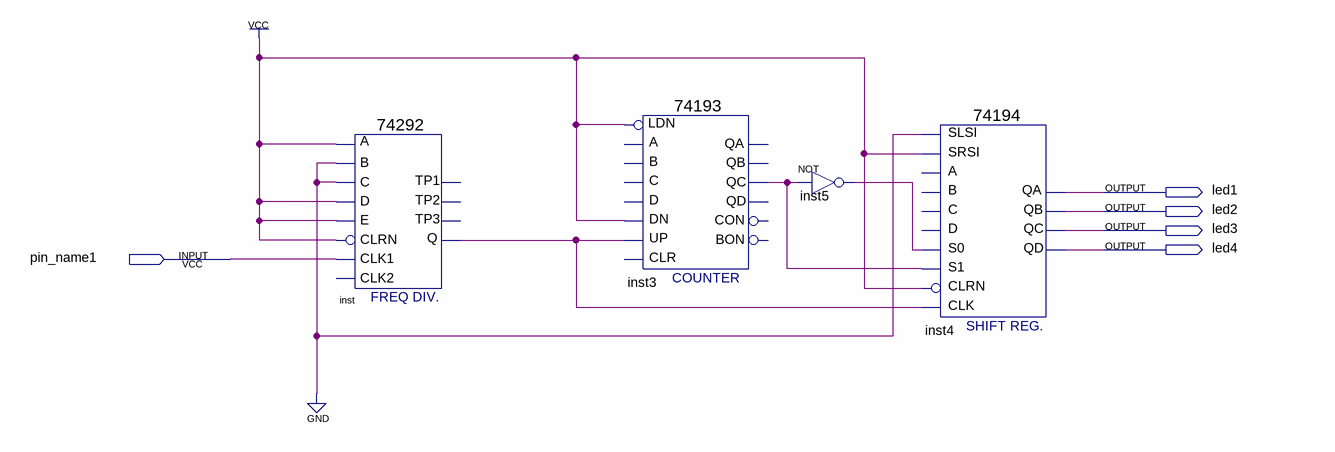
[diagram p0: schematic sheet]
// Quartus schematic Block1.bdf as structural Verilog: 4 symbols, 5 pins
module Block1 (
  input  pin_name1,
  output led1,
  output led2,
  output led3,
  output led4
);

  wire inst3_qc, inst5_out, inst_q;

  \74292  inst (
    .A(1'b1), .D(1'b1), .C(1'b0), .B(1'b0), .CLK1(pin_name1), .CLRN(1'b1), .E(1'b1), .Q(inst_q));  // open: CLK2, TP2, TP1, TP3
  \74193  inst3 (.UP(inst_q), .DN(1'b1), .LDN(1'b1), .QC(inst3_qc));  // open: D, C, B, A, CLR, QB, QA, CON, QD, BON
  not inst5 (inst5_out, inst3_qc);
  \74194  inst4 (
    .SLSI(1'b0), .SRSI(1'b1), .CLK(inst_q), .CLRN(1'b1), .S1(inst3_qc), .S0(inst5_out), .QA(led1), .QB(led2),
    .QC(led3), .QD(led4));  // open: B, C, D, A
endmodule
